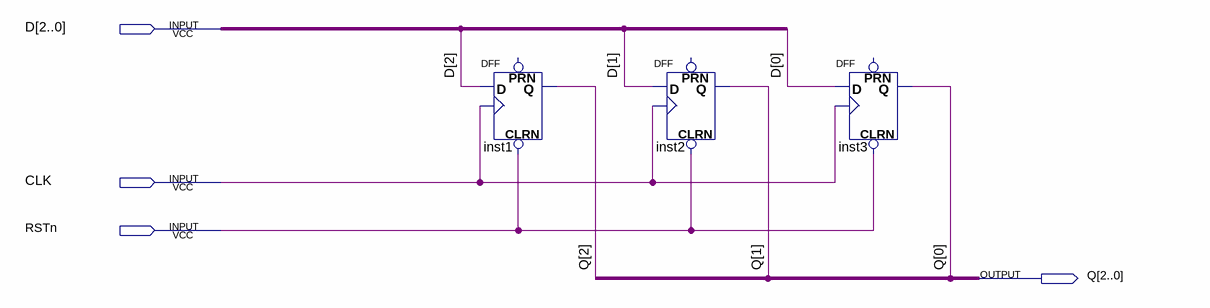
[diagram p0: schematic sheet]
// Quartus schematic DFF3.bdf as structural Verilog: 3 symbols, 4 pins
module DFF3 (
  input  [2:0] D,
  input  CLK,
  input  RSTn,
  output [2:0] Q
);

  DFF inst1 (.CLRN(RSTn), .CLK(CLK), .D(D[2]), .Q(Q[2]));  // open: PRN
  DFF inst2 (.CLRN(RSTn), .CLK(CLK), .D(D[1]), .Q(Q[1]));  // open: PRN
  DFF inst3 (.CLRN(RSTn), .CLK(CLK), .D(D[0]), .Q(Q[0]));  // open: PRN
endmodule
